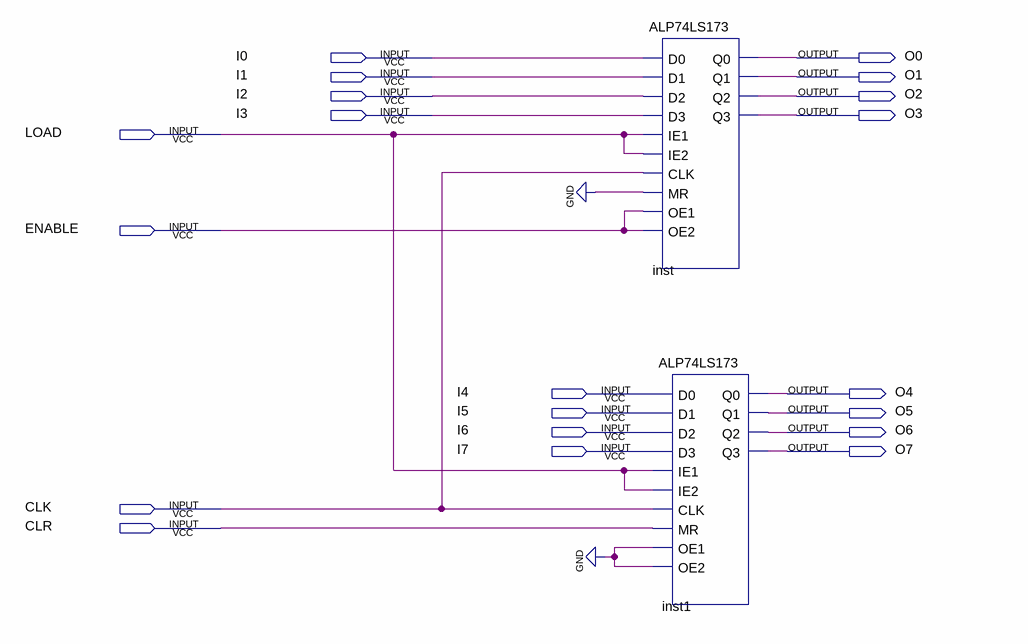
[diagram p0: schematic sheet]
// Quartus schematic RI.bdf as structural Verilog: 2 symbols, 20 pins
module RI (
  input  I0,
  input  I1,
  input  I2,
  input  I3,
  input  LOAD,
  input  ENABLE,
  input  I4,
  input  I5,
  input  I6,
  input  I7,
  input  CLK,
  input  CLR,
  output O0,
  output O1,
  output O2,
  output O3,
  output O4,
  output O5,
  output O6,
  output O7
);

  ALP74LS173 inst (
    .D0(I0), .D1(I1), .D2(I2), .D3(I3), .IE1(LOAD), .IE2(LOAD), .MR(1'b0), .OE1(ENABLE), .OE2(ENABLE),
    .CP(CLK), .Q0(O0), .Q1(O1), .Q2(O2), .Q3(O3));
  ALP74LS173 inst1 (
    .D0(I4), .D1(I5), .D2(I6), .D3(I7), .IE1(LOAD), .IE2(LOAD), .MR(CLR), .OE1(1'b0), .OE2(1'b0), .CP(CLK),
    .Q0(O4), .Q1(O5), .Q2(O6), .Q3(O7));
endmodule
